# Altium schematic sheet Power_6V.SchDoc
size A
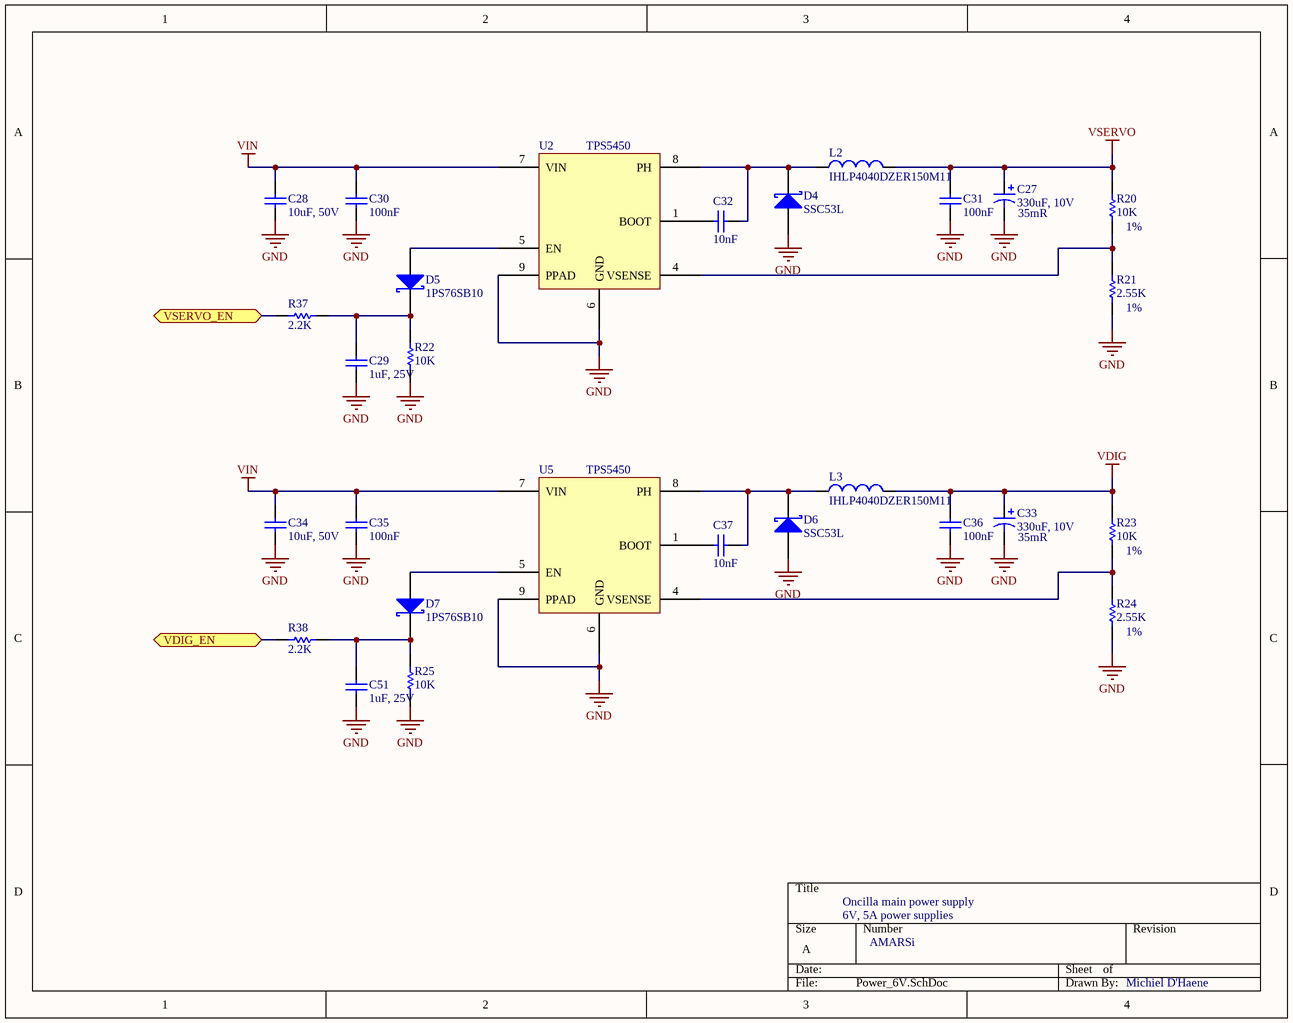
[diagram p0: Power_6V.SchDoc]

## Parts
C27  ESR: 35mR  [7343]  (hidden comment: 330uF, 10V)
C28  10uF, 50V  [CAPC3216L]
C29  1uF, 25V  [CAPC1608L]
C30  100nF  [CAPC1608L]
C31  100nF  [CAPC1608L]
C32  10nF  [CAPC1608L]
C33  ESR: 35mR  [7343]  (hidden comment: 330uF, 10V)
C34  10uF, 50V  [CAPC3216L]
C35  100nF  [CAPC1608L]
C36  100nF  [CAPC1608L]
C37  10nF  [CAPC1608L]
C51  1uF, 25V  [CAPC1608L]
D4  SSC53L  [SMC]
D5  1PS76SB10  [SOD323]
D6  SSC53L  [SMC]
D7  1PS76SB10  [SOD323]
L2  IHLP4040DZER150M11  [IHLP-4040DZ]
L3  IHLP4040DZER150M11  [IHLP-4040DZ]
R20  value 10K  Precision: 1%  [RESC1608L]  (hidden comment: 10k, 1%)
R21  value 2.55K  Precision: 1%  [RESC1608L]  (hidden comment: 2.55k, 1%)
R22  10k  [RESC1608L]
R23  value 10K  Precision: 1%  [RESC1608L]  (hidden comment: 10k, 1%)
R24  value 2.55K  Precision: 1%  [RESC1608L]  (hidden comment: 2.55k, 1%)
R25  10k  [RESC1608L]
R37  2.2k  [RESC1608L]
R38  2.2k  [RESC1608L]
U2  TPS5450  [SOIC8 POWERPAD]
U5  TPS5450  [SOIC8 POWERPAD]

## Ports
VDIG_EN, VSERVO_EN

## Nets
GND: C27.2 C28.1 C29.1 C30.1 C31.1 C33.2 C34.1 C35.1 C36.1 C51.1 D4.1(A) D6.1(A) R21.1 R22.1 R24.1 R25.1 U2.6(GND) U2.9(PPAD) U5.6(GND) U5.9(PPAD)
VDIG: C33.1 C36.2 L3.2 R23.2
VIN: C28.2 C30.2 C34.2 C35.2 U2.7(VIN) U5.7(VIN)
VSERVO: C27.1 C31.2 L2.2 R20.2
VDIG_EN: R38.2 ; port VDIG_EN
VSERVO_EN: R37.2 ; port VSERVO_EN
NetC29_2: C29.2 D5.1(K) R22.2 R37.1
NetC32_1: C32.1 U2.1(BOOT)
NetC32_2: C32.2 D4.2(K) L2.1 U2.8(PH)
NetC37_1: C37.1 U5.1(BOOT)
NetC37_2: C37.2 D6.2(K) L3.1 U5.8(PH)
NetC51_2: C51.2 D7.1(K) R25.2 R38.1
NetD5_2: D5.2(A) U2.5(EN)
NetD7_2: D7.2(A) U5.5(EN)
NetR20_1: R20.1 R21.2 U2.4(VSENSE)
NetR23_1: R23.1 R24.2 U5.4(VSENSE)

## Notes on the sheet
- Oncilla main power supply
- 6V, 5A power supplies
- AMARSi
- Michiel D'Haene

## Library data of the parts
C27 C33 = 255D157X06R3D2T045: Note: See Data Sheet for full range of components; Published: 19-Mar-2004; DatasheetDocument: 04-Feb-2003; PackageReference: 7343; Publisher: Altium Limited; Code_JEITA: 7343; ComponentLink1Description: Manufacturer Link; ComponentLink1URL: http://www.vishay.com/; ComponentLink2Description: Datasheet; ComponentLink2URL: http://www.vishay.com/docs/40052/255d.pdf; Value: 330uF, 10V
C28-C32 C34-C37 C51 = Cap Semi: Capacitor (Semiconductor SIM Model); Published: 8-Jun-2000; LatestRevisionDate: 29-May-2009; LatestRevisionNote: IPC-7351 Footprint Added.; PackageReference: C1206; Publisher: Altium Limited; PackageDescription: Chip Capacitor
  C28 C34: Value: 10uF, 50V
  C29 C51: Value: 1uF, 25V
  C30 C31 C35 C36: Value: 100nF
  C32 C37: Value: 10nF
D4 D6 = 30BQ040: Schottky Rectifier; Published: 8-Jun-2000; LatestRevisionDate: 17-Jul-2002; LatestRevisionNote: Re-released for DXP Platform.; DatasheetDocument: PD-2.439; PackageReference: SMC; Publisher: Altium Limited; Code_JEDEC: DO-214-AB; ComponentLink1Description: Manufacturer Link; ComponentLink1URL: http://www.irf.com/; ComponentLink2Description: Datasheet; ComponentLink2URL: http://www.irf.com/product-info/datasheets/data/30bq040.pdf
D5 D7 = 1PS76SB10: Schottky Barrier Diode; Published: 17-Sep-2003; LatestRevisionDate: 19-Mar-2004; LatestRevisionNote: Silkscreen size reduced.; DatasheetVersion: 14-Oct-1996; PackageVersion: May-1999; PackageReference: SOD323; Publisher: Altium Limited; PackageDescription: SOD-323/SC-76; 2 Leads; Body 1.7 x 1.3 mm, (LxW); ComponentLink1Description: Manufacturer Link; ComponentLink1URL: http://www.semiconductors.philips.com/; ComponentLink2Description: Datasheet; ComponentLink2URL: http://www.semiconductors.philips.com/acrobat/datasheets/1PS76SB10_2.pdf
L2 L3 = Inductor
R20 R21 R23 R24 = Res Semi: Semiconductor Resistor; Published: 8-Jun-2000; LatestRevisionDate: 17-Jul-2002; LatestRevisionNote: Re-released for DXP Platform.; PackageReference: AXIAL-0.5; Publisher: Altium Limited
R22 R25 R37 R38 = Res Semi: Semiconductor Resistor; Precision: 5%; Published: 8-Jun-2000; LatestRevisionDate: 17-Jul-2002; LatestRevisionNote: Re-released for DXP Platform.; PackageReference: AXIAL-0.5; Publisher: Altium Limited
  R22 R25: Value: 10K
  R37 R38: Value: 2.2K